# Altium schematic sheet PLC_RaspberryPi.SchDoc
size A4
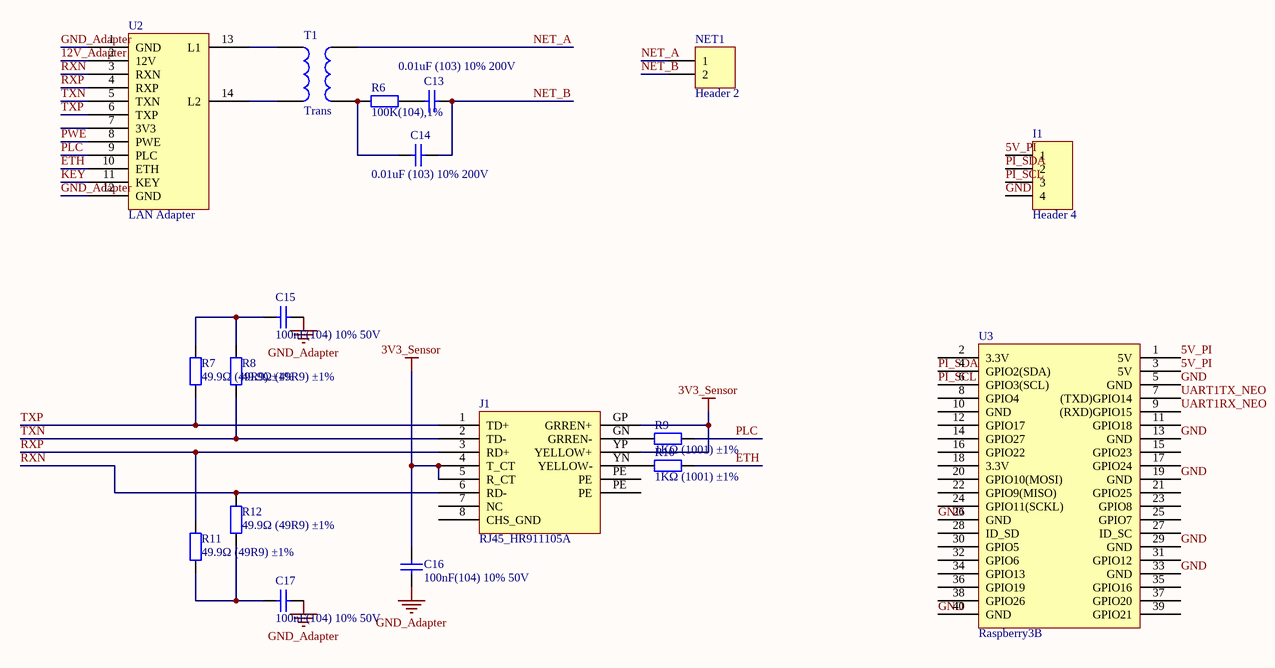
[diagram p0: PLC_RaspberryPi.SchDoc]

## Parts
C13  0.01uF (103) 10% 200V  [1206_C]
C14  0.01uF (103) 10% 200V  [1206_C]
C15  100nF(104) 10% 50V  [0603_C]
C16  100nF(104) 10% 50V  [0603_C]
C17  100nF(104) 10% 50V  [0603_C]
I1  Header 4  [XH2.54_4P]
J1  RJ45_HR911105A  [RJ45_3]
NET1  Header 2  [XH2.54_2P]
R6  100K(104),1%  [1206_R]
R7  49.9Ω (49R9) ±1%  [0603_R]
R8  49.9Ω (49R9) ±1%  [0603_R]
R9  1KΩ (1001) ±1%  [0603_R]
R10  1KΩ (1001) ±1%  [0603_R]
R11  49.9Ω (49R9) ±1%  [0603_R]
R12  49.9Ω (49R9) ±1%  [0603_R]
T1  Trans  [SW-80]
U2  LAN Adapter  [LAN Adapter]
U3  Raspberry3B  [HDR2X20]

## Nets
3V3_Sensor: C16.2 J1.4(T_CT) J1.5(R_CT) J1.GP(GRREN+) J1.YP(YELLOW+)
GND_Adapter: C15.1 C16.1 C17.1 U2.1(GND) U2.12(GND)
5V_PI: I1.1 U3.1(5V) U3.3(5V)
12V_Adapter: U2.2(12V)
ETH: R10.2 U2.10(ETH)
GND: I1.4 U3.5(GND) U3.13(GND) U3.19(GND) U3.26(GND) U3.29(GND) U3.33(GND) U3.40(GND)
KEY: U2.11(KEY)
NET_A: NET1.1 T1.3
NET_B: C13.1 C14.1 NET1.2
PI_SCL: I1.3 U3.6(GPIO3(SCL))
PI_SDA: I1.2 U3.4(GPIO2(SDA))
PLC: R9.2 U2.9(PLC)
PWE: U2.8(PWE)
RXN: J1.6(RD-) R12.2 U2.3(RXN)
RXP: J1.3(RD+) R11.2 U2.4(RXP)
TXN: J1.2(TD-) R8.1 U2.5(TXN)
TXP: J1.1(TD+) R7.1 U2.6(TXP)
UART1RX_NEO: U3.9((RXD)GPIO15)
UART1TX_NEO: U3.7((TXD)GPIO14)
NetC13_2: C13.2 R6.2
NetC14_2: C14.2 R6.1 T1.4
NetC15_2: C15.2 R7.2 R8.2
NetC17_2: C17.2 R11.1 R12.1
NetJ1_GN: J1.GN(GRREN-) R9.1
NetJ1_YN: J1.YN(YELLOW-) R10.1
NetT1_1: T1.1 U2.13(L1)
NetT1_2: T1.2 U2.14(L2)

Not connected (* = marked no-connect by the designer): J1 7(NC) 8(CHS_GND) PE; U2 7(3V3); U3 2(3.3V) 8(GPIO4) 10(GND) 11(GPIO18) 12(GPIO17) 14(GPIO27) 15(GPIO23) 16(GPIO22) 17(GPIO24) 18(3.3V) 20(GPIO10(MOSI)) 21(GPIO25) 22(GPIO9(MISO)) 23(GPIO8) 24(GPIO11(SCKL)) 25(GPIO7) 27(ID_SC) 28(ID_SD) 30(GPIO5) 31(GPIO12) 32(GPIO6) 34(GPIO13) 35(GPIO16) 36(GPIO19) 37(GPIO20) 38(GPIO26) 39(GPIO21)

## Library data of the parts
C13 C14 = Cap: Capacitor; Value: 104; Published: 8-Jun-2000; LatestRevisionDate: 17-Jul-2002; LatestRevisionNote: Re-released for DXP Platform.; Publisher: Altium Limited
C15-C17 = 0805 100nF(104) 10% 50V: 贴片电容; ComponentLink1Description: 供应商链接; ComponentLink1URL: http://www.szlcsc.com/product/details_50686.html; Package: 0805; Supplier: LC; SuppliersPartNumber: C49678
I1 = Header 4: Header, 4-Pin; LatestRevisionDate: 17-Jul-2002; LatestRevisionNote: Re-released for DXP Platform.; Publisher: Altium Limited
NET1 = Header 2: Header, 2-Pin; LatestRevisionDate: 17-Jul-2002; LatestRevisionNote: Re-released for DXP Platform.; Publisher: Altium Limited
R6 = Res2: Resistor; Published: 8-Jun-2000; LatestRevisionDate: 17-Jul-2002; LatestRevisionNote: Re-released for DXP Platform.; Publisher: Altium Limited
R7 R8 R11 R12 = 0805 49.9Ω (49R9) 1%: 贴片电阻; ComponentLink1Description: 供应商链接; ComponentLink1URL: http://www.szlcsc.com/product/details_18408.html; Package: 0805; Supplier: LC; SuppliersPartNumber: C17720
R9 R10 = 0603 1KΩ (1001) 1%: 贴片电阻; ComponentLink1Description: 供应商链接; ComponentLink1URL: http://www.szlcsc.com/product/details_21904.html; Package: 0603; Supplier: LC; SuppliersPartNumber: C21190
T1 = Trans: Transformer; Published: 24-Mar-1999; LatestRevisionDate: 08-Jul-2005; LatestRevisionNote: Mech Layer 1 removed.; PackageReference: TRANS; Publisher: Altium Limited; PackageDescription: Transformer; 4 Leads